# Altium schematic sheet Top.SchDoc
size B; SheetNumber: 1; SheetTotal: 5
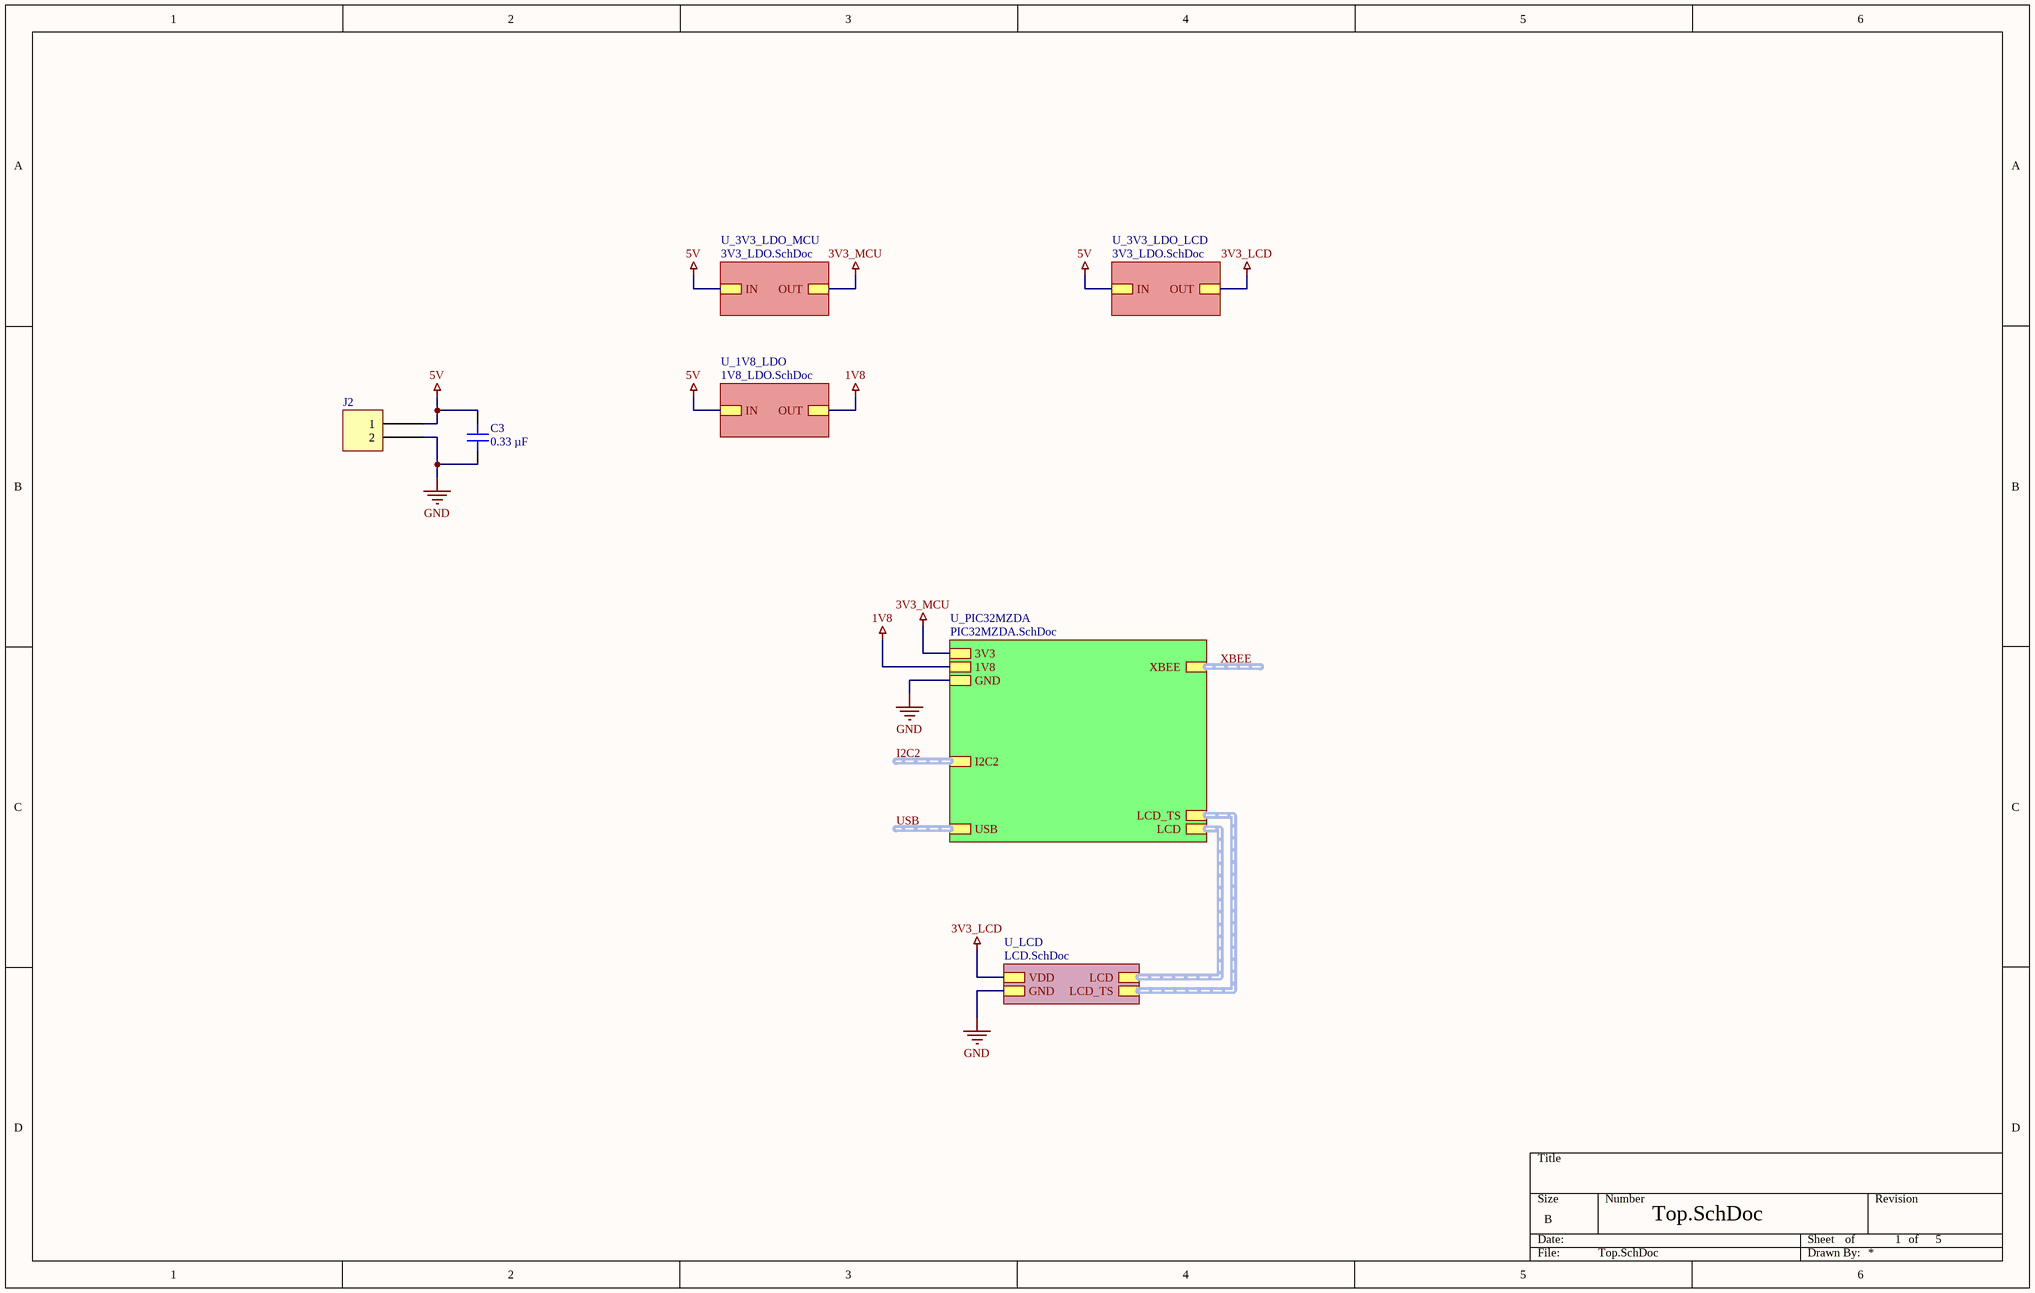
[diagram p0: Top.SchDoc]

## Parts
C3  0.33 µF  [CAP 0603_1608]
J2  S2B-PH-SM4-TB(LF)(SN)  [JST S2B-PH-SM4-TB]  (value not drawn)

## Sub-sheets
U_1V8_LDO = 1V8_LDO.SchDoc: OUT, IN
U_3V3_LDO_LCD = 3V3_LDO.SchDoc: OUT, IN
U_3V3_LDO_MCU = 3V3_LDO.SchDoc: OUT, IN
U_LCD = LCD.SchDoc: VDD, GND, LCD (harness LCD), LCD_TS (harness LCD_TS)
U_PIC32MZDA = PIC32MZDA.SchDoc: 1V8, GND, 3V3, LCD (harness LCD), USB (harness USB), I2C2 (harness I2C), LCD_TS (harness LCD_TS), XBEE (harness XBEE)

## Nets
1V8: sheet U_PIC32MZDA/1V8, sheet U_1V8_LDO/OUT
3V3_LCD: sheet U_LCD/VDD, sheet U_3V3_LDO_LCD/OUT
3V3_MCU: sheet U_3V3_LDO_MCU/OUT, sheet U_PIC32MZDA/3V3
5V: C3.2 J2.1 ; sheet U_3V3_LDO_MCU/IN, sheet U_3V3_LDO_LCD/IN, sheet U_1V8_LDO/IN
GND: C3.1 J2.2 ; sheet U_PIC32MZDA/GND, sheet U_LCD/GND

## Buses and harness runs
harness I2C2 = sheet U_PIC32MZDA/I2C2
harness sheet U_LCD/LCD = sheet U_PIC32MZDA/LCD
harness sheet U_LCD/LCD_TS = sheet U_PIC32MZDA/LCD_TS
harness USB = sheet U_PIC32MZDA/USB
harness XBEE = sheet U_PIC32MZDA/XBEE

## Notes on the sheet
- of

## Library data of the parts
C3 = CL10B334KP8NNNC: CAP CER 0.33UF 10V X7R 0603; manufacturer: Samsung Electro-Mechanics; Tolerance: ±10%; Part Number: CL10B334KP8NNNC; Value: 0.33 µF; Applications: General Purpose; Capacitance: 0.33 µF; componentlink1description: Datasheet; componentlink1url: http://www.samsungsem.com/kr/support/product-search/mlcc/CL10B334KP8NNNC.jsp; componentlink2description: DigiKey Link; componentlink2url: https://www.digikey.com/en/products/detail/samsung-electro-mechanics/CL10B334KP8NNNC/3887471; Device Package: 0603 (1608 Metric); lastupdated: 1/3/2023 8:07:17 PM; Lifecycle Status: Active; Minimum Order: 1; Mounting Type: Surface Mount, MLCC; Operating Temperature: -55°C ~ 125°C; Package / Case: 0603 (1608 Metric); packaging: TapeAndReel; partid: 13456; Part Status: Active; price: 0.01; series: CL; Size / Dimension: 0.063" L x 0.031" W (1.60mm x 0.80mm); Supplier 1: DigiKey; Supplier Part Number 1: 1276-1813-1-ND; Temperature Coefficient: X7R; Thickness (Max): 0.035" (0.90mm); Voltage - Rated: 10V
J2 = S2B-PH-SM4-TB(LF)(SN): CONN HEADER SMD R/A 2POS 2MM; Manufacturer: JST Sales America Inc.; Contact Length - Mating: 0.130" (3.30mm); Current Rating (Amps): 2A; Material Flammability Rating: UL94 V-0; Number of Positions: 2; Number of Positions Loaded: All; Pitch - Mating: 0.079" (2.00mm); Shrouding: Shrouded - 4 Wall; Style: Board to Cable/Wire; Voltage Rating: 100V; Part Number: S2B-PH-SM4-TB(LF)(SN); ComponentLink1Description: Datasheet; ComponentLink1URL: http://www.jst-mfg.com/product/pdf/eng/ePH.pdf; ComponentLink2Description: DigiKey Link; ComponentLink2URL: http://digikey.com/product-detail/en/jst-sales-america-inc/S2B-PH-SM4-TB-LF-SN/455-1749-1-ND/926846; Connector Type: Header; Contact Finish - Mating: Tin; Contact Finish - Post: Tin; Contact Material: Copper Alloy; Contact Shape: Square; Contact Type: Male Pin; Fastening Type: Detent Lock; Features: Solder Retention; Insulation Color: Natural; Insulation Height: 0.217" (5.51mm); Insulation Material: Polyamide (PA6T), Nylon 6T; LastUpdated: 1/15/2020 3:45:11 AM; Lifecycle Status: Active; Minimum Order: 1; Mounting Type: Surface Mount, Right Angle; Number of Rows: 1; Operating Temperature: -25°C ~ 85°C; Packaging: TapeAndReel; PartId: 115; Part Status: Active; Price: 0.27; Series: PH; Supplier 1: DigiKey; Supplier Part Number 1: 455-1749-1-ND; Termination: Solder